# Altium schematic sheet menu_pulsadores.SchDoc
size 127 x 101 mm; PageSetup: Record=PageOptions|CenterHorizontal=True|CenterVertical=True|PrintScale=1.05|XCorrection=1.00|YCorrection=1.00|PrintKind=0|BorderSize=5000000|LeftOffset=0|BottomOffset=0|Orientation=2|PaperLength=1000|PaperWidth=1000|Scale=100|PaperSource=7|PrintQuality=-4|MediaType=1|DitherType=10|PaperKind=A4 (8.2 x 11.7 in; 210 x 297 mm)|PrintScaleMode=1
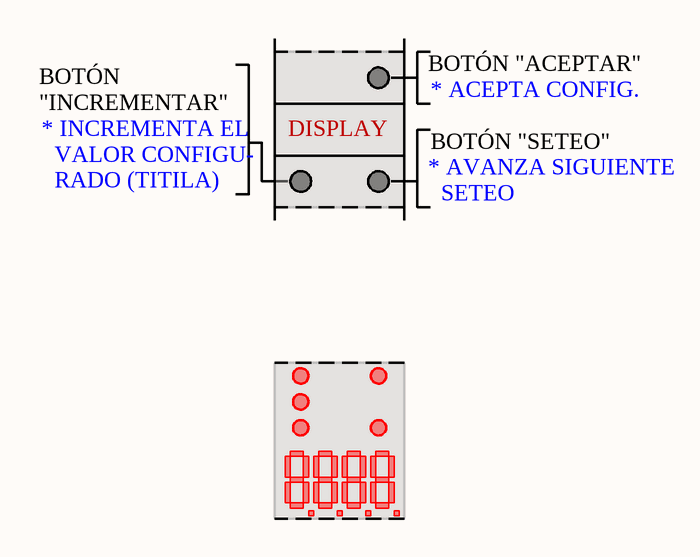
[diagram p0: menu_pulsadores.SchDoc]

## Notes on the sheet
- BOTÓN
- BOTÓN "ACEPTAR"
- "INCREMENTAR"
- * INCREMENTA EL
- VALOR CONFIGU-
- RADO (TITILA)
- DISPLAY
- * AVANZA SIGUIENTE
- BOTÓN "SETEO"
- * ACEPTA CONFIG.
- SETEO